# Altium schematic sheet Schieberegister_Trägerplatine.SchDoc
size A4; SheetNumber: 1; SheetTotal: 1; SPICEModelCacheYDPVZOWB: <root> / <DocumentId>YDPVZOWB</DocumentId> / </root>
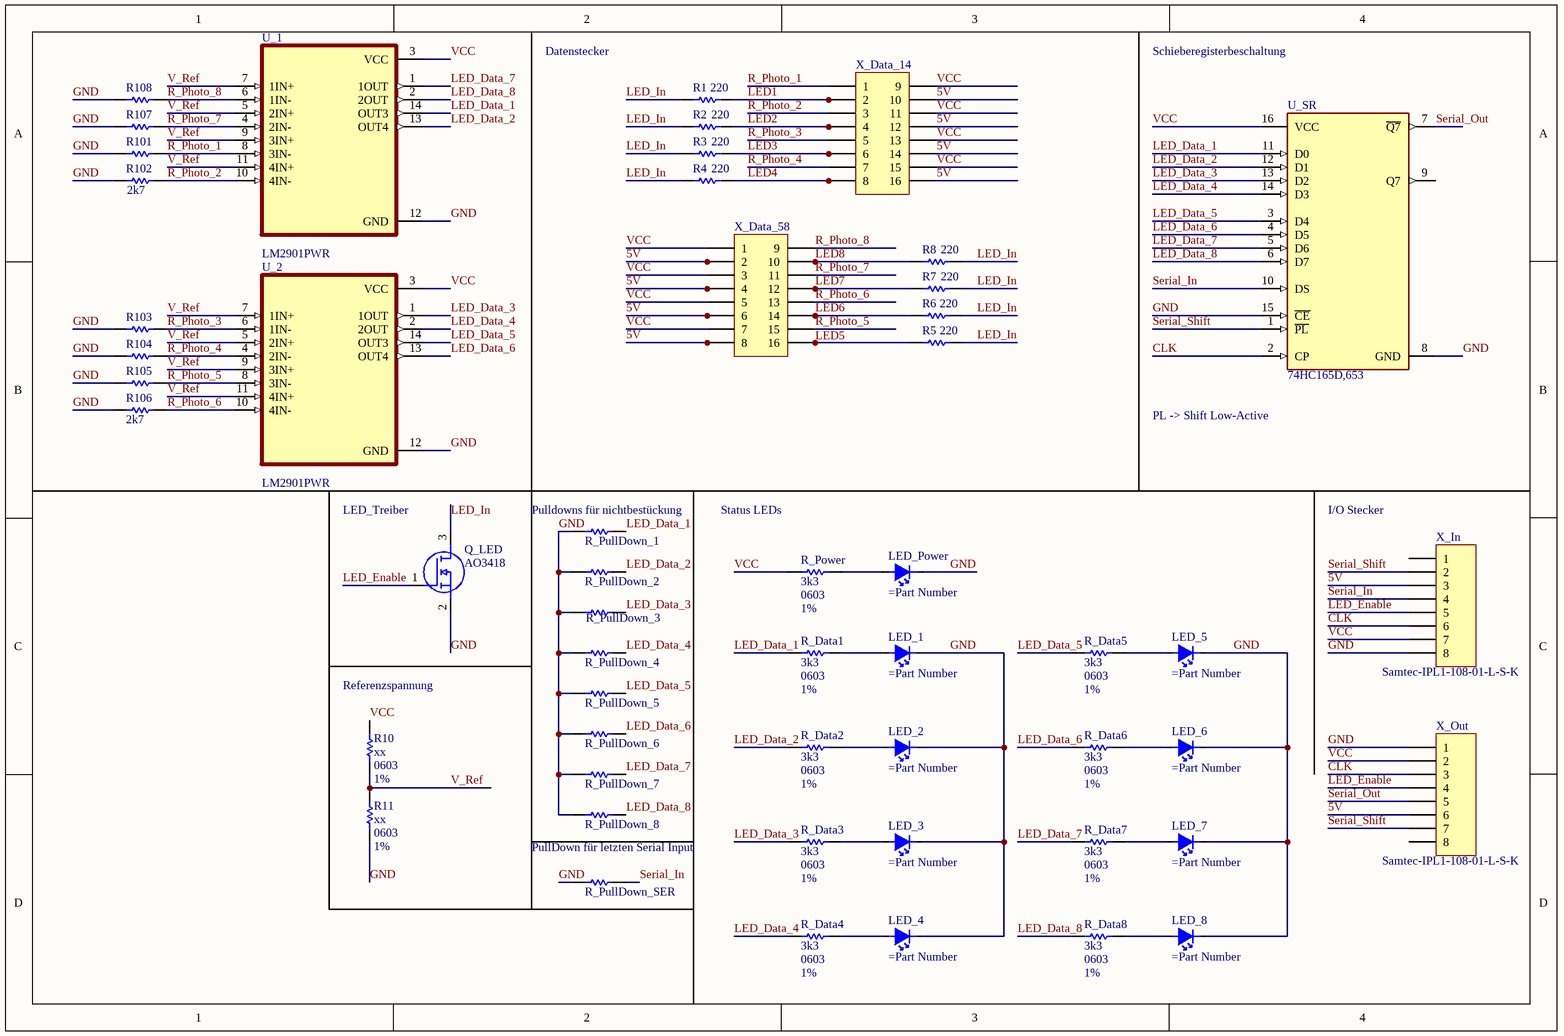
[diagram p0: Schieberegister_Trägerplatine.SchDoc]

## Parts
LED_1  (no value)  [150060XX75000]
LED_2  (no value)  [150060XX75000]
LED_3  (no value)  [150060XX75000]
LED_4  (no value)  [150060XX75000]
LED_5  (no value)  [150060XX75000]
LED_6  (no value)  [150060XX75000]
LED_7  (no value)  [150060XX75000]
LED_8  (no value)  [150060XX75000]
LED_Power  (no value)  [150060XX75000]
Q_LED  AO3418  [SOT95P280X125-3N]
R1  value 220  [0603_resistor_flat]
R2  value 220  [0603_resistor_flat]
R3  value 220  [0603_resistor_flat]
R4  value 220  [0603_resistor_flat]
R5  value 220  [0603_resistor_flat]
R6  value 220  [0603_resistor_flat]
R7  value 220  [0603_resistor_flat]
R8  value 220  [0603_resistor_flat]
R10  value xx  Case_EIA: 0603  Tolerance: 1%  [0603_resistor_flat]
R11  value xx  Case_EIA: 0603  Tolerance: 1%  [0603_resistor_flat]
R101  (no value)  [0603_resistor_flat]
R102  2k7  [0603_resistor_flat]
R103  (no value)  [0603_resistor_flat]
R104  (no value)  [0603_resistor_flat]
R105  (no value)  [0603_resistor_flat]
R106  2k7  [0603_resistor_flat]
R107  (no value)  [0603_resistor_flat]
R108  (no value)  [0603_resistor_flat]
R_Data1  value 3k3  Case_EIA: 0603  Tolerance: 1%  [0603_resistor_flat]
R_Data2  value 3k3  Case_EIA: 0603  Tolerance: 1%  [0603_resistor_flat]
R_Data3  value 3k3  Case_EIA: 0603  Tolerance: 1%  [0603_resistor_flat]
R_Data4  value 3k3  Case_EIA: 0603  Tolerance: 1%  [0603_resistor_flat]
R_Data5  value 3k3  Case_EIA: 0603  Tolerance: 1%  [0603_resistor_flat]
R_Data6  value 3k3  Case_EIA: 0603  Tolerance: 1%  [0603_resistor_flat]
R_Data7  value 3k3  Case_EIA: 0603  Tolerance: 1%  [0603_resistor_flat]
R_Data8  value 3k3  Case_EIA: 0603  Tolerance: 1%  [0603_resistor_flat]
R_Power  value 3k3  Case_EIA: 0603  Tolerance: 1%  [0603_resistor_flat]
R_PullDown_1  (no value)  [0603_resistor_flat]
R_PullDown_2  (no value)  [0603_resistor_flat]
R_PullDown_3  (no value)  [0603_resistor_flat]
R_PullDown_4  (no value)  [0603_resistor_flat]
R_PullDown_5  (no value)  [0603_resistor_flat]
R_PullDown_6  (no value)  [0603_resistor_flat]
R_PullDown_7  (no value)  [0603_resistor_flat]
R_PullDown_8  (no value)  [0603_resistor_flat]
R_PullDown_SER  (no value)  [0603_resistor_flat]
U_1  LM2901PWR  [SOP65P640X120-14N]
U_2  LM2901PWR  [SOP65P640X120-14N]
U_SR  74HC165D,653  [FP-SOT109-1-MFG]
X_Data_14  Samtec-IPL1-108-01-L-D-K  [Samtec-IPL1-108-01-L-D-K]  (value not drawn)
X_Data_58  Samtec-IPL1-108-01-L-D-K  [Samtec-IPL1-108-01-L-D-K]  (value not drawn)
X_In  Samtec-IPL1-108-01-L-S-K  [Samtec-IPL1-108-01-L-S-K]
X_Out  Samtec-IPL1-108-01-L-S-K  [Samtec-IPL1-108-01-L-S-K]

## Nets
5V: X_Data_14.10 X_Data_14.12 X_Data_14.14 X_Data_14.16 X_Data_58.2 X_Data_58.4 X_Data_58.6 X_Data_58.8 X_In.3 X_Out.6
CLK: U_SR.2(CP) X_In.6 X_Out.3
GND: LED_1.1(Cathode) LED_2.1(Cathode) LED_3.1(Cathode) LED_4.1(Cathode) LED_5.1(Cathode) LED_6.1(Cathode) LED_7.1(Cathode) LED_8.1(Cathode) LED_Power.1(Cathode) Q_LED.2(S) R11.1 R101.1 R102.1 R103.1 R104.1 R105.1 R106.1 R107.1 R108.1 R_PullDown_1.1 R_PullDown_2.1 R_PullDown_3.1 R_PullDown_4.1 R_PullDown_5.1 R_PullDown_6.1 R_PullDown_7.1 R_PullDown_8.1 R_PullDown_SER.1 U_1.12(GND) U_2.12(GND) U_SR.8(GND) U_SR.15(~{CE}) X_In.8 X_Out.1
LED1: R1.1 X_Data_14.2
LED2: R2.1 X_Data_14.4
LED3: R3.1 X_Data_14.6
LED4: R4.1 X_Data_14.8
LED5: R5.1 X_Data_58.16
LED6: R6.1 X_Data_58.14
LED7: R7.1 X_Data_58.12
LED8: R8.1 X_Data_58.10
LED_Data_1: R_Data1.2 R_PullDown_1.2 U_1.14(OUT3) U_SR.11(D0)
LED_Data_2: R_Data2.2 R_PullDown_2.2 U_1.13(OUT4) U_SR.12(D1)
LED_Data_3: R_Data3.2 R_PullDown_3.2 U_2.1(1OUT) U_SR.13(D2)
LED_Data_4: R_Data4.2 R_PullDown_4.2 U_2.2(2OUT) U_SR.14(D3)
LED_Data_5: R_Data5.2 R_PullDown_5.2 U_2.14(OUT3) U_SR.3(D4)
LED_Data_6: R_Data6.2 R_PullDown_6.2 U_2.13(OUT4) U_SR.4(D5)
LED_Data_7: R_Data7.2 R_PullDown_7.2 U_1.1(1OUT) U_SR.5(D6)
LED_Data_8: R_Data8.2 R_PullDown_8.2 U_1.2(2OUT) U_SR.6(D7)
LED_Enable: Q_LED.1(G) X_In.5 X_Out.4
LED_In: Q_LED.3(D) R1.2 R2.2 R3.2 R4.2 R5.2 R6.2 R7.2 R8.2
R_Photo_1: R101.2 U_1.8(3IN-) X_Data_14.1
R_Photo_2: R102.2 U_1.10(4IN-) X_Data_14.3
R_Photo_3: R103.2 U_2.6(1IN-) X_Data_14.5
R_Photo_4: R104.2 U_2.4(2IN-) X_Data_14.7
R_Photo_5: R105.2 U_2.8(3IN-) X_Data_58.15
R_Photo_6: R106.2 U_2.10(4IN-) X_Data_58.13
R_Photo_7: R107.2 U_1.4(2IN-) X_Data_58.11
R_Photo_8: R108.2 U_1.6(1IN-) X_Data_58.9
Serial_In: R_PullDown_SER.2 U_SR.10(DS) X_In.4
Serial_Out: U_SR.7(~{Q7}) X_Out.5
Serial_Shift: U_SR.1(~{PL}) X_In.2 X_Out.7
V_Ref: R10.1 R11.2 U_1.5(2IN+) U_1.7(1IN+) U_1.9(3IN+) U_1.11(4IN+) U_2.5(2IN+) U_2.7(1IN+) U_2.9(3IN+) U_2.11(4IN+)
VCC: R10.2 R_Power.2 U_1.3(VCC) U_2.3(VCC) U_SR.16(VCC) X_Data_14.9 X_Data_14.11 X_Data_14.13 X_Data_14.15 X_Data_58.1 X_Data_58.3 X_Data_58.5 X_Data_58.7 X_In.7 X_Out.2
NetLED_1_2: LED_1.2(Anode) R_Data1.1
NetLED_2_2: LED_2.2(Anode) R_Data2.1
NetLED_3_2: LED_3.2(Anode) R_Data3.1
NetLED_4_2: LED_4.2(Anode) R_Data4.1
NetLED_5_2: LED_5.2(Anode) R_Data5.1
NetLED_6_2: LED_6.2(Anode) R_Data6.1
NetLED_7_2: LED_7.2(Anode) R_Data7.1
NetLED_8_2: LED_8.2(Anode) R_Data8.1
NetLED_Power_2: LED_Power.2(Anode) R_Power.1

Not connected (* = marked no-connect by the designer): U_SR 9(Q7); X_In 1; X_Out 8

## Notes on the sheet
- Datenstecker
- Schieberegisterbeschaltung
- PL -> Shift Low-Active
- (near Q_LED) LED_Treiber
- (near R_PullDown_1) Pulldowns für nichtbestückung
- Status LEDs
- I/O Stecker
- (near R10) Referenzspannung
- PullDown für letzten Serial Input

## Library data of the parts
LED_1-LED_8 LED_Power = LED_0603: 0603 SMD mono-color Chip LED, WL-SMCW / BS: Blue, GS: Green, RS: Red, SS: super red, VS: bright green, YS: yellow; Part Number: 150060*75000; Manufacturer: Würth; possible_colors: BS, GS, RS, SS, VS, YS; Case_EIA: 0603; Color: *
Q_LED = AO3418: MOSFET N-CH 30V 3.8A SOT23; Manufacturer_Name: Alpha & Omega Semiconductors; Geometry.Height: 1.25mm; Arrow Part Number: AO3418; Arrow Price/Stock: https://www.arrow.com/en/products/ao3418/alpha-and-omega-semiconductor; Manufacturer_Part_Number: AO3418; Datasheet Link: https://www.arrow.com/en/products/ao3418/alpha-and-omega-semiconductor
R1-R8 R101-R108 R_PullDown_1-R_PullDown_8 R_PullDown_SER = R_0603: Resistor, 0603, 5% default, 0.1 W; E12: 1K0, 1K2, 1K5, 1K8, 2K2, 2K7, 3K3, 3K9, 4K7, 5K6, 6K8, 8K2; Case_Metric: 1608; Power_Dissipation: 100mW; Part Number: ='R_' + Case_EIA + '_' + Tolerance + '_' + Value
R10 R11 = R_0603: Resistor, 0603, 5% default, 0.1 W; Part Number: R_0603_1%_xx; E12: 1K0, 1K2, 1K5, 1K8, 2K2, 2K7, 3K3, 3K9, 4K7, 5K6, 6K8, 8K2; Case_Metric: 1608; Power_Dissipation: 100mW
R_Data1-R_Data8 R_Power = R_0603: Resistor, 0603, 5% default, 0.1 W; Part Number: R_0603_1%_3k3; E12: 1K0, 1K2, 1K5, 1K8, 2K2, 2K7, 3K3, 3K9, 4K7, 5K6, 6K8, 8K2; Case_Metric: 1608; Power_Dissipation: 100mW
U_1 U_2 = LM2901PWR: Quad differential comparator, automotive grade 14-TSSOP -40 to 125; MF: Texas; Check_prices: https://www.snapeda.com/parts/LM2901PWR/Texas%20Instruments/view-part/1145769/?ref=eda; Price: None; SnapEDA_Link: https://www.snapeda.com/parts/LM2901PWR/Texas%20Instruments/view-part/1145769/?ref=snap; Availability: Good; MP: LM2901PWR; Value: *; Purchase-URL: https://pricing.snapeda.com/search/part/LM2901PWR/?ref=eda; Package: TSSOP-14 Rohm
U_SR = CMP-14351-000001-1: IC SHIFT REGST 8BIT PI-SO 16SOIC; Manufacturer: Nexperia; Standoff Height: 0.1mm; Number Of Inputs: 8; Logic Function Desc: Shift Register; Nominal Supply Current: 8uA; Number Of Circuits: 1; Propagation Delay: 15ns; Min Supply Voltage: 2V; Frequency: 61MHz; Max Supply Voltage: 6V; Height: 1.75mm; Digikey Description: IC SHIFT REGST 8BIT PI-SO 16SOIC; ComponentLink2URL: https://assets.nexperia.com/documents/data-sheet/74HC_HCT165.pdf; Ipc Land Pattern Name: SOP127P600X175-16; Temperature Range High: +125°C; Manufacturer Part Number: 74HC165D,653; Temperature: -40°C to +125°C; Device Class L2: Logic ICs; Device Class L1: Integrated Circuits (ICs); Lead Free: Yes; Number Of Outputs: 1; Ambient Temperature Range High: +125°C; ComponentLink2Description: Datasheet; Temperature Range Low: -40°C; Category: IC; RoHS: TRUE; Automotive: No; Device Class L3: Shift Registers; Octopart: https://octopart.com/74hc165d%2C653-nexperia-78737091; Footprint Url: https://assets.nexperia.com/documents/outline-drawing/SOT109-1.pdf; Ambient Temperature Range Low: -40°C; Package: SOT109-1
X_Data_14 X_Data_58 = Samtec-IPL1-108-01-L-D-K: Header, 8-Pin, Dual row; Value: Samtec; LatestRevisionDate: 17-Jul-2002; LatestRevisionNote: Re-released for DXP Platform.; Publisher: Altium Limited
X_In X_Out = IPL1-108-01-L-S-K: Header, 8-Pin; LatestRevisionDate: 17-Jul-2002; LatestRevisionNote: Re-released for DXP Platform.; Publisher: Altium Limited; Value: Samtec-IPL1-108-01-L-S-K